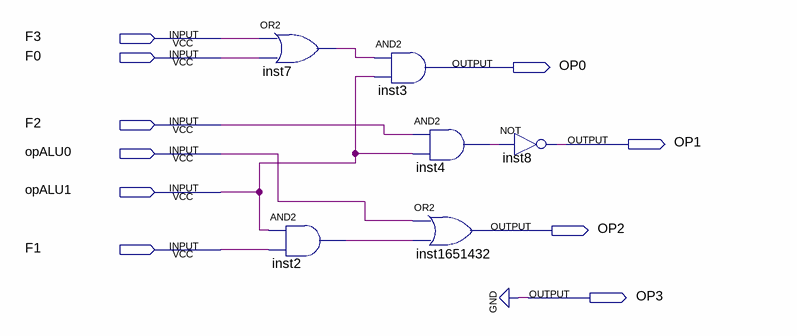
[diagram p0: schematic sheet]
// Quartus schematic ALUControl.bdf as structural Verilog: 6 symbols, 10 pins
module ALUControl (
  input  F3,
  input  F0,
  input  F2,
  input  opALU0,
  input  opALU1,
  input  F1,
  output OP0,
  output OP1,
  output OP2,
  output OP3
);

  wire inst2_out, inst4_out, inst7_out;

  or inst7 (inst7_out, F3, F0);
  and inst2 (inst2_out, opALU1, F1);
  and inst3 (OP0, inst7_out, opALU1);
  and inst4 (inst4_out, F2, opALU1);
  or inst1651432 (OP2, opALU0, inst2_out);
  not inst8 (OP1, inst4_out);

  assign OP3 = 1'b0;
endmodule
